# EAGLE design pro_mini_a7105_shield (EAGLE 6.5.0)
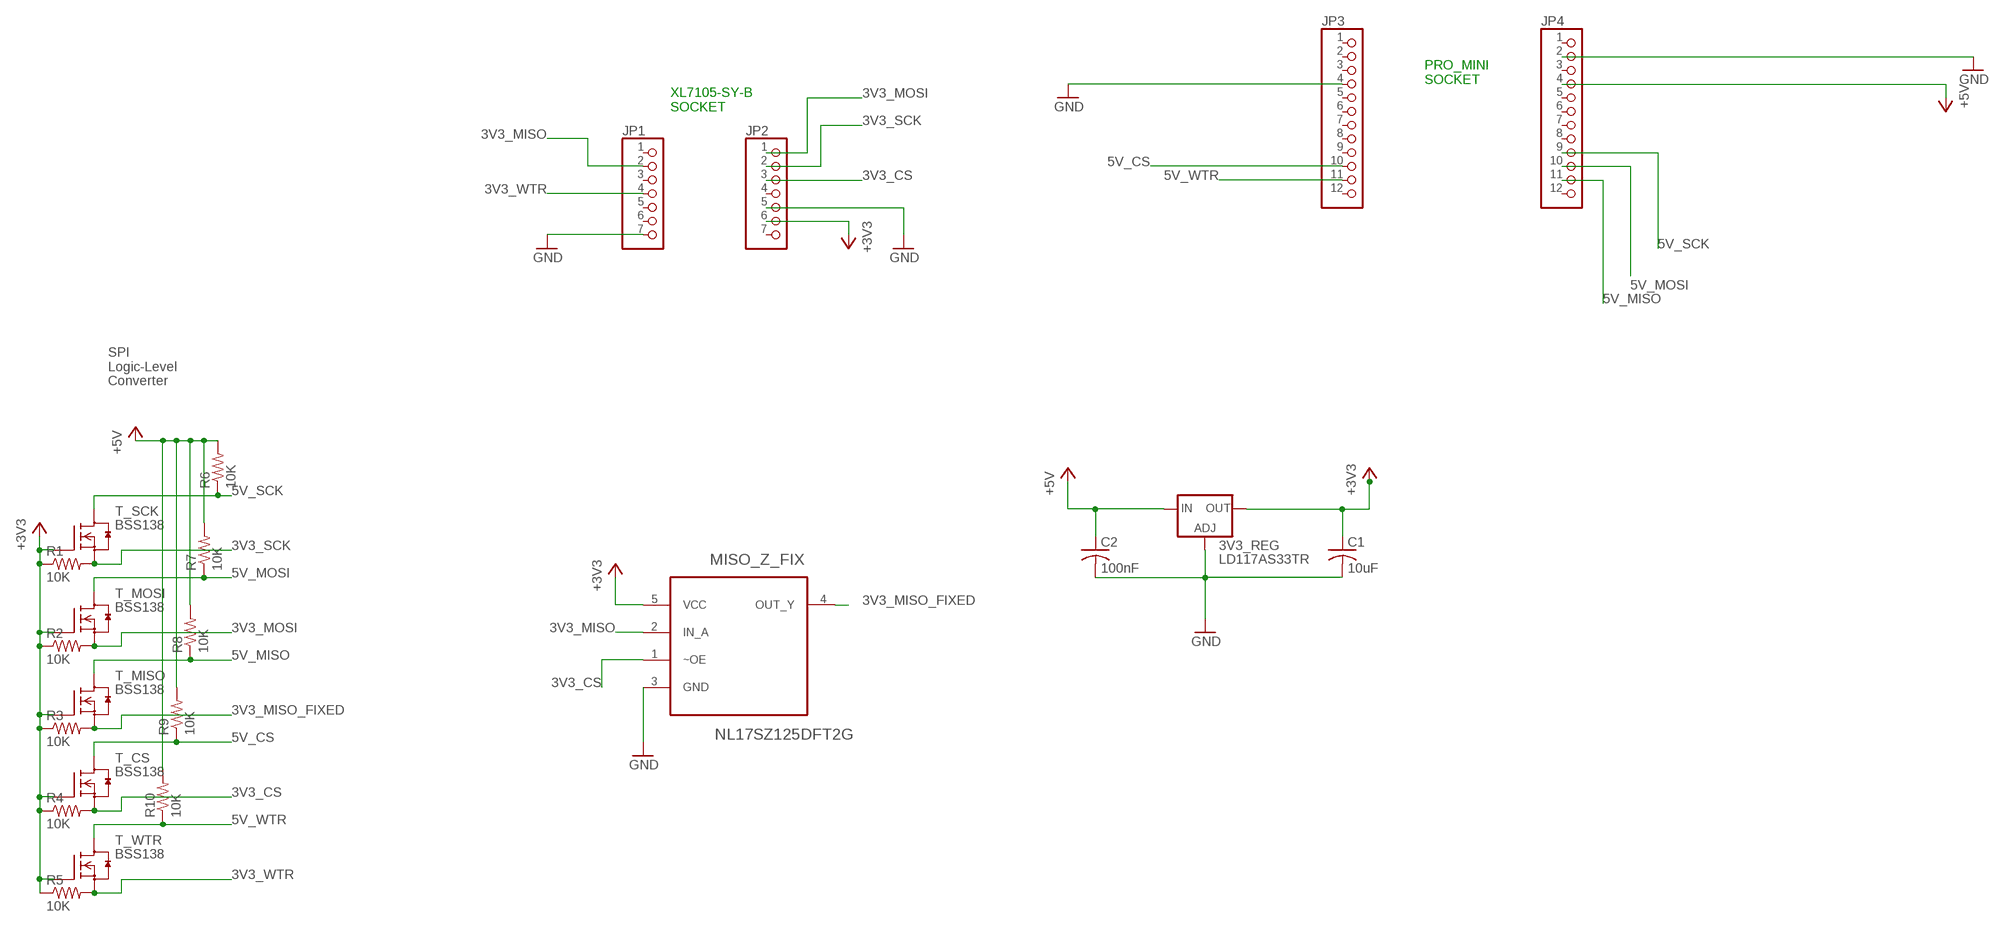
[diagram p0: schematic, sheet 1]

## Parts
3V3_REG  LD117AS33TR  [SOT223]
C1  10uF  C-USC0805  [C0805]
C2  100nF  C-USC0805  [C0805]
JP1  PINHD-1X7M  [1X07M]
JP2  PINHD-1X7M  [1X07M]
JP3  PINHD-1X12  [1X12]
JP4  PINHD-1X12  [1X12]
MISO_Z_FIX  NL17SZ125DFT2G  [SOT65P210X110-5N]
R1  10K  R-US_R0805  [R0805]
R2  10K  R-US_R0805  [R0805]
R3  10K  R-US_R0805  [R0805]
R4  10K  R-US_R0805  [R0805]
R5  10K  R-US_R0805  [R0805]
R6  10K  R-US_R0805  [R0805]
R7  10K  R-US_R0805  [R0805]
R8  10K  R-US_R0805  [R0805]
R9  10K  R-US_R0805  [R0805]
R10  10K  R-US_R0805  [R0805]
T_CS  BSS138  [SOT23]
T_MISO  BSS138  [SOT23]
T_MOSI  BSS138  [SOT23]
T_SCK  BSS138  [SOT23]
T_WTR  BSS138  [SOT23]

## Nets
3V3_CS: JP2.3 MISO_Z_FIX.1(~OE) R4.2 T_CS.2(S)
3V3_MISO: JP1.2 MISO_Z_FIX.2(IN_A)
3V3_MISO_FIXED: MISO_Z_FIX.4(OUT_Y) R3.2 T_MISO.2(S)
3V3_MOSI: JP2.1 R2.2 T_MOSI.2(S)
3V3_SCK: JP2.2 R1.2 T_SCK.2(S)
3V3_WTR: JP1.4 R5.2 T_WTR.2(S)
5V_CS: JP3.10 R9.1 T_CS.3(D)
5V_MISO: JP4.11 R8.1 T_MISO.3(D)
5V_MOSI: JP4.10 R7.1 T_MOSI.3(D)
5V_SCK: JP4.9 R6.1 T_SCK.3(D)
5V_WTR: JP3.11 R10.1 T_WTR.3(D)
+3V3: 3V3_REG.4(OUT) C1.1 JP2.6 MISO_Z_FIX.5(VCC) R1.1 R2.1 R3.1 R4.1 R5.1 T_CS.1(G) T_MISO.1(G) T_MOSI.1(G) T_SCK.1(G) T_WTR.1(G)
+5V: 3V3_REG.3(IN) C2.1 JP4.4 R6.2 R7.2 R8.2 R9.2 R10.2
GND: 3V3_REG.1(ADJ) C1.2 C2.2 JP1.7 JP2.5 JP3.4 JP4.2 MISO_Z_FIX.3(GND)
Unconnected: JP1.1 JP1.3 JP1.5 JP1.6 JP2.4 JP2.7 JP3.1 JP3.2 JP3.3 JP3.5 JP3.6 JP3.7 JP3.8 JP3.9 JP3.12 JP4.1 JP4.3 JP4.5 JP4.6 JP4.7 JP4.8 JP4.12

## Notes on the sheet
- PRO_MINI
  SOCKET
- XL7105-SY-B
  SOCKET
- SPI
  Logic-Level
  Converter

## Library data of the parts
3V3_REG = v-reg:LD117A?*: Low drop fixed and adjustable positive voltage regulators 1 A Source: http://www.st.com/stonline/products/literature/ds/7194/ld1117axx.pdf
C1 C2 = rcl:C-US: CAPACITOR, American symbol
JP1 JP2 = bob_starr_pinhead:PINHD-1X7: PIN HEADER
JP3 JP4 = bob_starr_pinhead:PINHD-1X12: PIN HEADER
MISO_Z_FIX = ON Semiconductor_By_element14_Batch_1:NL17SZ125DFT2G: Non-Inverting 3-State Buffer; MPN: NL17SZ125DFT2G; OC_FARNELL: 1468775; OC_NEWARK: 83H7736; PACKAGE: SC70-5; SUPPLIER: ON SEMICONDUCTOR
R1-R10 = resistor:R-US_: RESISTOR, American symbol
T_CS T_MISO T_MOSI T_SCK T_WTR = m-pad-2.1:BSS138: Fairchild Semiconductors BSS138 N-Channel Logic Level Enhancement Mode Field Effect Transistor General Description: These N-Channel enhancement mode field effect transistors are produced using Fairchild's proprietary, high cell density, DMOS technology. These products have been designed to minimize on-state resistance while provide rugged, reliable, and fast switching performance.These products are particularly suited for low voltage, low current applications such as small servo motor control, power MOSFET gate drivers, and other switching applications. Features: 0.22 A, 50 V. RDS(ON) = 3.5Ohm @ VGS = 10 V RDS(ON) = 6.0Ohm @ VGS = 4.5 V High density cell design for extremely low RDS(ON) Rugged and Reliable Compact industry standard SOT-23 surface mount package Please send any comments to: messi@users.sourceforge.net

## Board
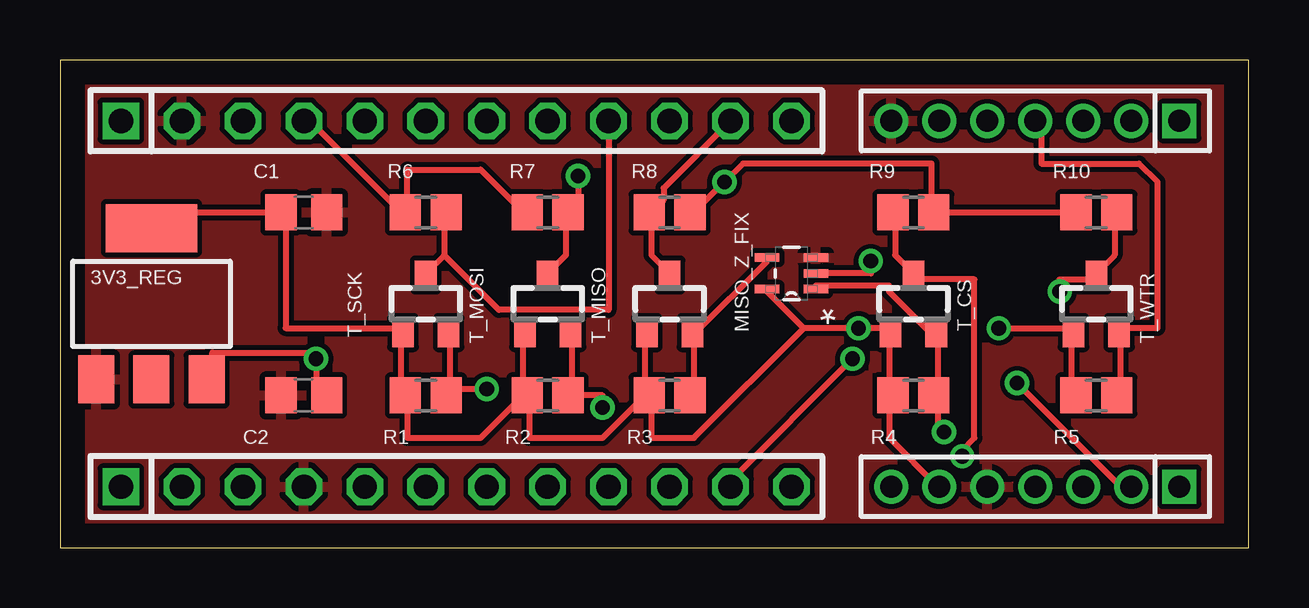
[diagram p1: board, top side]
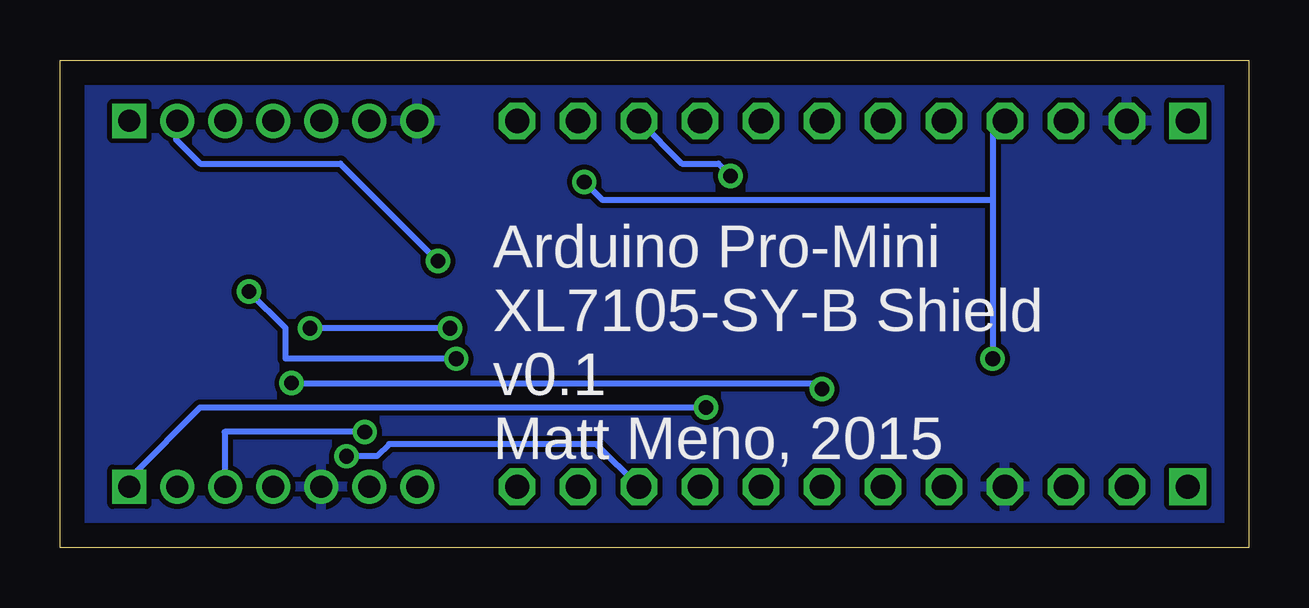
[diagram p2: board, bottom side, seen from below]

Size 49.53 x 20.32 mm. Coordinates in mm from the lower left corner, seen from the top.
Outline: 0,0 49.53,0 49.53,20.32 0,20.32 0,0
Copper layers (1*16): Top 0.035mm / dielectric 1.5mm / Bottom 0.035mm
Design rules "default": minimum track width 10mil, minimum drill 24mil, track to track 8mil, track to pad 8mil, pad to pad 8mil, via to via 8mil, smd to smd 8mil, copper to edge 40mil, drill to drill 8mil, minimum pad ring 10mil, minimum via ring 8mil, stop-mask expansion 4mil, vias tented up to drill 0mil, thermal gap 10mil

### Footprints (pad centres in the part's own frame; a part is rotated, then mirrored left to right if it is on the bottom)
SOT223 = smd 1.5 x 2: 1 -2.3,-3.15; 2 0,-3.15; 3 2.3,-3.15 | smd 3.8 x 2: 4 0,3.15
C0805 = smd 1.3 x 1.5: 1 -0.95,0; 2 0.95,0
1X07M = drill 0.914 square: 1 -6,0 | drill 0.914: 2 -4,0; 3 -2,0; 4 0,0; 5 2,0; 6 4,0; 7 6,0
1X12 = drill 1.016 square: 1 -13.97,0 | drill 1.016 octagon: 2 -11.43,0; 3 -8.89,0; 4 -6.35,0; 5 -3.81,0; 6 -1.27,0; 7 1.27,0; 8 3.81,0; 9 6.35,0; 10 8.89,0; 11 11.43,0; 12 13.97,0
SOT65P210X110-5N = smd 1.016 x 0.356: 1 -1.016,0.66; 2 -1.016,0; 3 -1.016,-0.66; 4 1.016,-0.66; 5 1.016,0.66
R0805 = smd 1.3 x 1.5: 1 -0.85,0; 2 0.85,0
SOT23 = smd 0.9 x 1.2: 1 -0.95,-1.2; 2 0.95,-1.2; 3 0,1.2

### Placement (x,y rotation side)
3V3_REG  3.81,10.16 0 top
C1  10.16,13.97 0 top
C2  10.16,6.35 180 top
JP1  40.64,17.78 180 top
JP2  40.64,2.54 180 top
JP3  16.51,2.54 0 top
JP4  16.51,17.78 0 top
MISO_Z_FIX  30.48,11.43 180 top
R1  15.24,6.35 0 top
R2  20.32,6.35 0 top
R3  25.4,6.35 0 top
R4  35.56,6.35 0 top
R5  43.18,6.35 0 top
R6  15.24,13.97 180 top
R7  20.32,13.97 180 top
R8  25.4,13.97 0 top
R9  35.56,13.97 0 top
R10  43.18,13.97 180 top
T_CS  35.56,10.16 0 top
T_MISO  25.4,10.16 0 top
T_MOSI  20.32,10.16 0 top
T_SCK  15.24,10.16 0 top
T_WTR  43.18,10.16 0 top

### Tracks (layer width: path | path; a pad name or v marks a point on that pad's centre or on a via)
3V3_CS  (via drill 0.61)
  Top 0.254: MISO_Z_FIX.1 31.5,10.92 34.54,10.92 34.54,10.67 36.32,8.89 T_CS.2 36.58,8.89 36.58,6.35 | v36.83,4.83 36.58,5.08 36.58,6.35 | 36.58,6.35 R4.2
  Bottom 0.254: v36.83,4.83 42.67,4.83 42.67,2.54 JP2.3
3V3_MISO  (via drill 0.61)
  Top 0.254: MISO_Z_FIX.2 33.78,11.43 v33.78,11.94
  Bottom 0.254: v33.78,11.94 37.85,16 43.69,16 44.7,17.02 44.7,17.78 JP1.2
3V3_MISO_FIXED
  Top 0.254: 26.42,8.89 29.46,11.94 MISO_Z_FIX.4 | 26.42,8.89 26.42,6.35 R3.2 | 26.42,8.89 T_MISO.2
3V3_MOSI  (via drill 0.61)
  Top 0.254: 21.34,6.35 21.34,8.89 T_MOSI.2 | 21.34,6.35 22.61,6.35 v22.61,5.84 | 21.34,6.35 R2.2
  Bottom 0.254: v22.61,5.84 43.69,5.84 46.48,3.05 46.48,2.54 JP2.1
3V3_SCK  (via drill 0.61)
  Top 0.254: 16.26,6.6 16.26,6.35 R1.2 16.26,6.6 | 16.26,6.6 16.26,8.89 T_SCK.2 | v17.78,6.6 16.26,6.6 | v39.88,6.86 44.2,2.54 JP2.2
  Bottom 0.254: v17.78,6.6 18.03,6.86 v39.88,6.86
3V3_WTR
  Top 0.254: R5.2 44.2,6.35 44.2,8.89 T_WTR.2 44.2,9.14 45.72,9.14 45.72,15.24 44.96,16 40.89,16 40.89,17.53 JP1.4
5V_CS  (via drill 0.61)
  Top 0.254: R9.1 34.8,13.97 34.8,12.19 35.56,11.43 T_CS.3 35.56,11.18 38.1,11.18 38.1,4.57 37.59,4.06 v37.59,3.81
  Bottom 0.254: v37.59,3.81 36.32,3.81 35.81,4.32 27.18,4.32 JP3.10
5V_MISO
  Top 0.254: 24.64,13.97 24.64,12.19 25.4,11.43 T_MISO.3 | 24.64,13.97 25.15,14.48 25.15,14.99 JP4.11 | 24.64,13.97 R8.1
5V_MOSI  (via drill 0.61)
  Top 0.254: T_MOSI.3 20.32,11.43 21.08,12.19 21.08,13.97 R7.1 21.34,13.97 21.59,14.22 v21.59,15.49
  Bottom 0.254: v21.59,15.49 22.1,16 23.62,16 JP4.10
5V_SCK
  Top 0.254: 16,12.19 15.24,11.43 T_SCK.3 | 16,12.19 16,13.97 R6.1 | 16,12.19 18.29,9.91 22.86,9.91 JP4.9
5V_WTR  (via drill 0.61)
  Top 0.254: R10.1 43.94,13.97 43.94,12.19 43.18,11.43 T_WTR.3 43.18,11.18 41.66,11.18 v41.66,10.67 | v33.02,7.87 27.94,2.79 JP3.11
  Bottom 0.254: v41.66,10.67 40.13,9.14 40.13,7.87 v33.02,7.87
+3V3  (via drill 0.61)
  Top 0.254: R5.1 42.16,6.35 42.16,8.89 T_WTR.1 42.16,9.14 v39.12,9.14 | 30.99,9.14 29.46,10.67 MISO_Z_FIX.5 | 30.99,9.14 v33.27,9.14 34.54,9.14 T_CS.1 34.54,8.89 34.54,6.35 | 34.54,6.35 34.54,4.57 36.58,2.54 JP2.6 | 34.54,6.35 R4.1 | 24.38,6.35 24.38,8.89 T_MISO.1 | 19.3,6.35 19.3,8.89 T_MOSI.1 | 3V3_REG.4 3.81,13.97 C1.1 9.4,13.97 9.4,9.14 14.22,9.14 T_SCK.1 14.22,8.89 14.22,6.35 R1.1 14.48,6.35 14.48,4.57 17.53,4.57 19.3,6.35 | 19.3,6.35 R2.1 19.56,6.35 19.56,4.57 22.61,4.57 24.38,6.35 | 24.38,6.35 R3.1 24.64,6.35 24.64,4.57 26.42,4.57 30.99,9.14
  Bottom 0.254: v33.27,9.14 v39.12,9.14
+5V  (via drill 0.61)
  Top 0.254: R8.2 26.42,13.97 v27.69,15.24 28.45,16 36.32,16 36.32,13.97 R9.2 R10.2 | C2.1 10.92,6.35 10.67,6.6 v10.67,7.87 10.41,8.13 6.35,8.13 6.35,7.11 3V3_REG.3 | JP4.4 10.41,17.78 14.22,13.97 R6.2 14.48,13.97 14.48,15.75 17.53,15.75 19.3,13.97 R7.2
  Bottom 0.254: 10.67,14.48 10.67,17.78 JP4.4 | 10.67,14.48 v10.67,7.87 | v27.69,15.24 26.92,14.48 10.67,14.48
GND
  pour Top: -2.54,21.59 -2.54,-1.27 52.07,-1.27 52.07,22.86 -2.54,22.86
  pour Bottom: -2.54,20.32 -2.54,-1.27 52.07,-1.27 52.07,21.59 -2.54,21.59

### Text on the board
bNames: Arduino Pro-Mini / XL7105-SY-B Shield / v0.1 / Matt Meno, 2015